# Altium project ODrive_Foc.PrjPcb
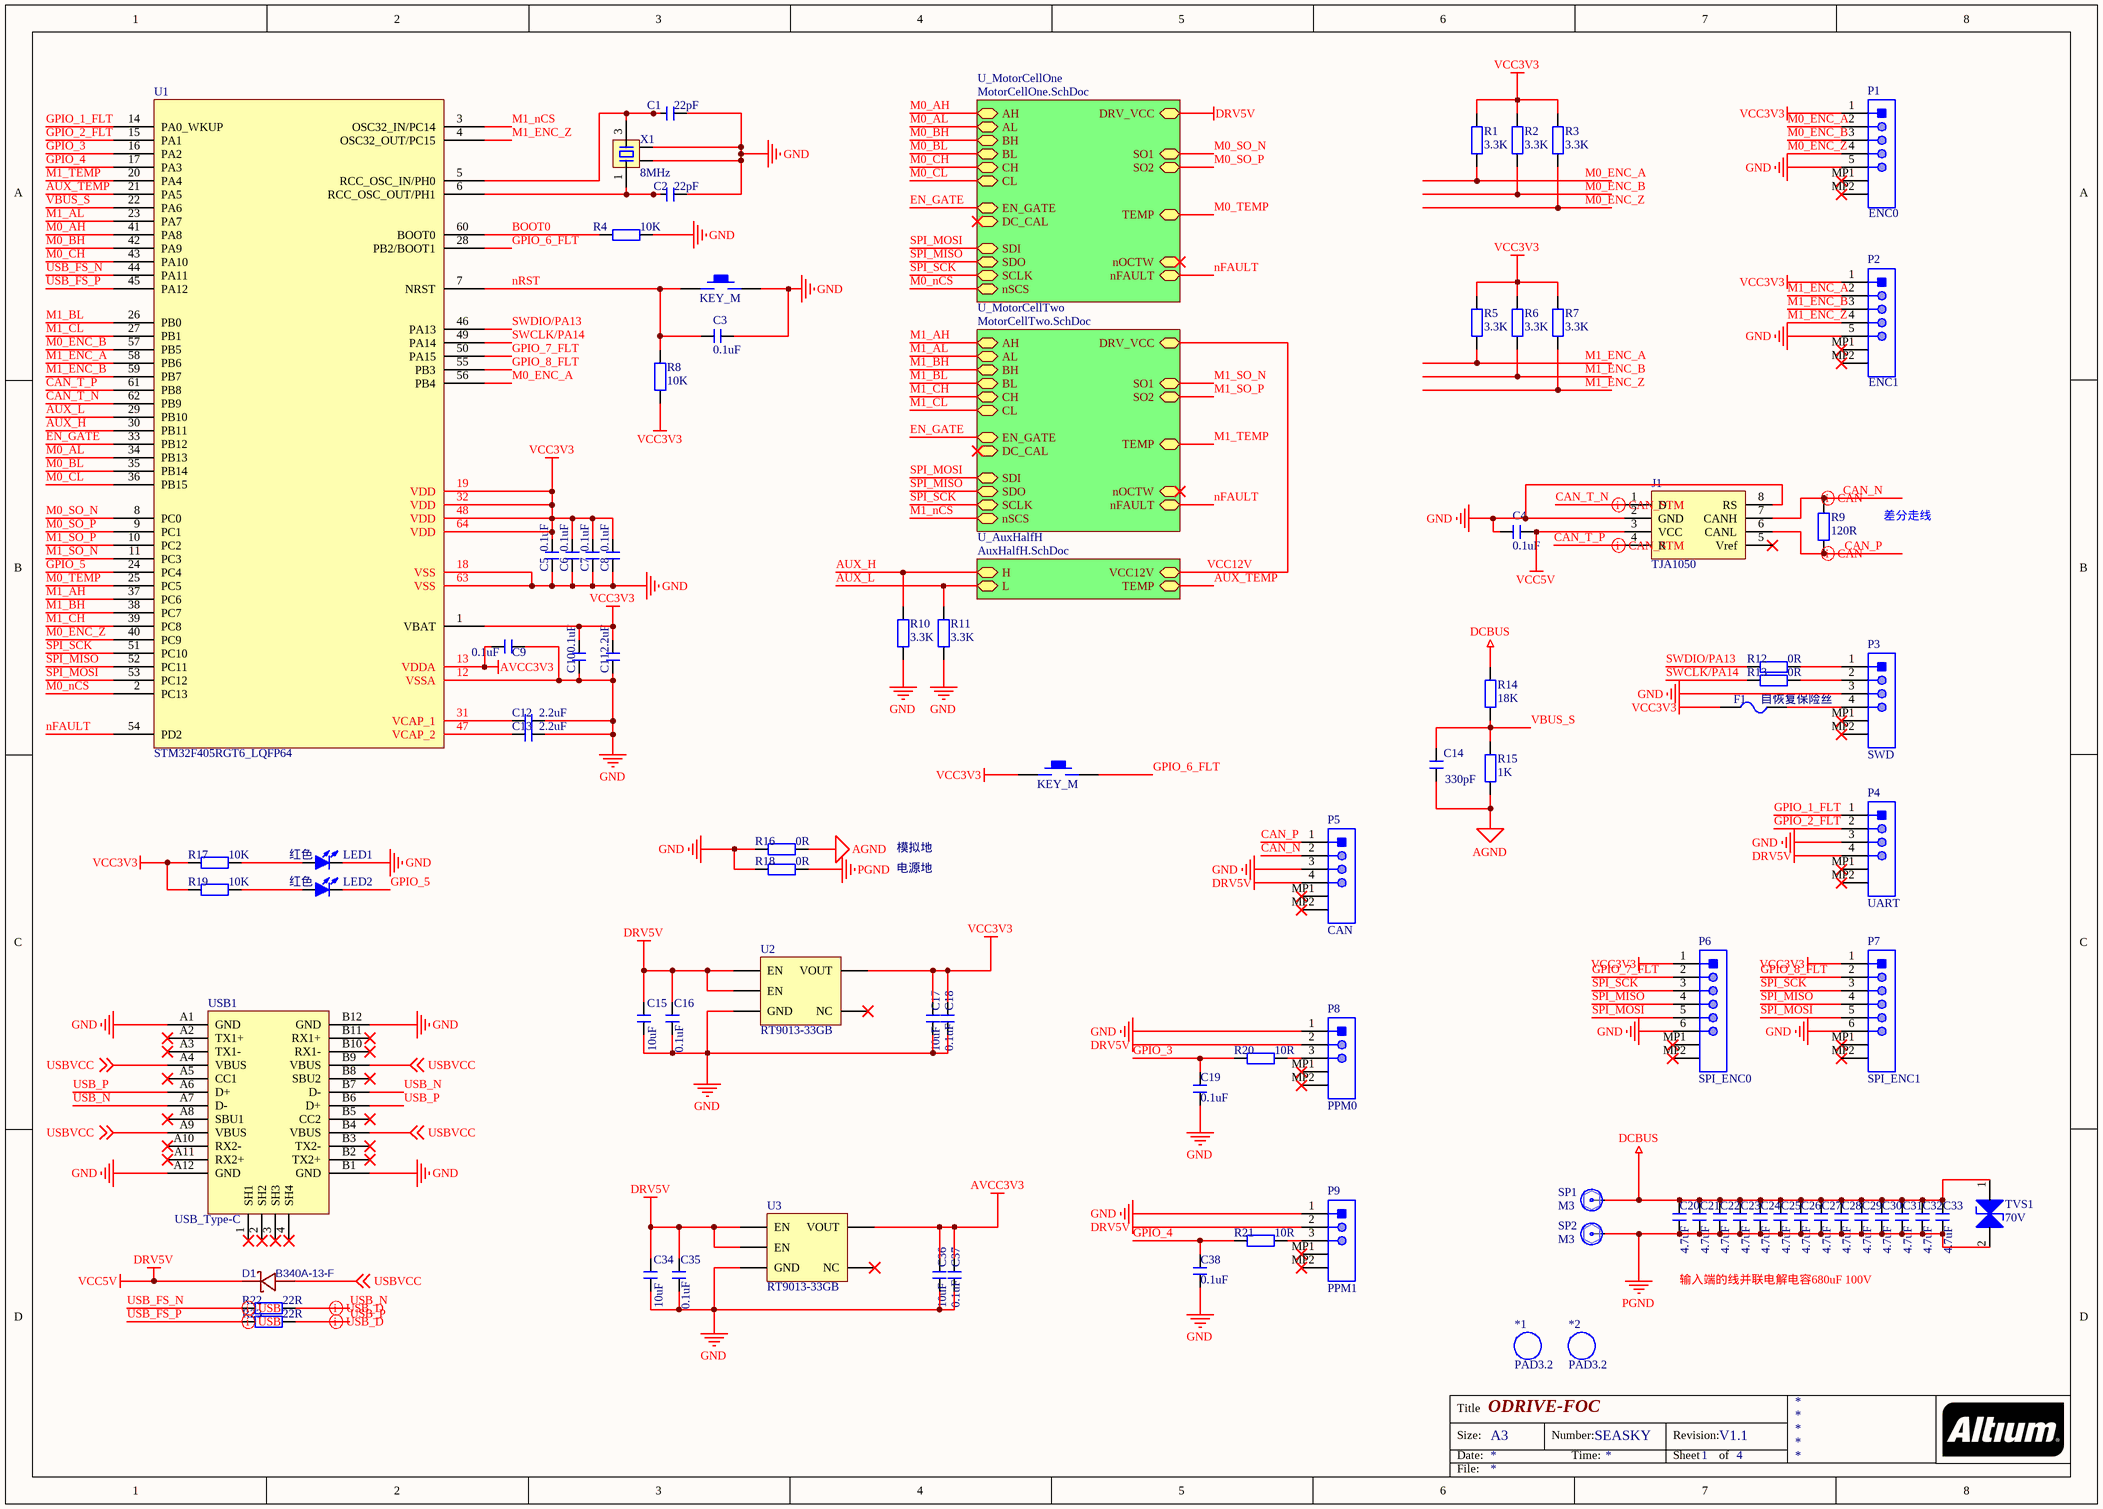
[diagram p0: CoreCtrl.SchDoc]
4 sheets, 208 parts. Net scope: hierarchical (ports join the sheet entries above them; power ports are global).
Board file: Drive_Foc.PcbDoc
Sheets:
  CoreCtrl.SchDoc
    U_AuxHalfH = AuxHalfH.SchDoc
    U_MotorCellOne = MotorCellOne.SchDoc
    U_MotorCellTwo = MotorCellTwo.SchDoc

## Sheet CoreCtrl.SchDoc: ODRIVE-FOC
size A3; Author: SEASKY; DocumentNumber: SEASKY; Revision: V1.1; SheetNumber: 1; SheetTotal: 4; Application_BuildNumber: 0

### Parts
*1  PAD3.2  [PAD3.2]
*2  PAD3.2  [PAD3.2]
C1  22pF  [C 0603_L]
C2  22pF  [C 0603_L]
C3  0.1uF  [C 0603_L]
C4  0.1uF  [C 0603_L]
C5  0.1uF  [C 0603_L]
C6  0.1uF  [C 0603_L]
C7  0.1uF  [C 0603_L]
C8  0.1uF  [C 0603_L]
C9  0.1uF  [C 0603_L]
C10  0.1uF  [C 0603_L]
C11  2.2uF  [C 0603_L]
C12  2.2uF  [C 0603_L]
C13  2.2uF  [C 0603_L]
C14  330pF  [C 0603_L]
C15  10uF  [C 0805_L]
C16  0.1uF  [C 0805_L]
C17  10uF  [C 0805_L]
C18  0.1uF  [C 0805_L]
C19  0.1uF  [C 0603_L]
C20  4.7uF  [C 1210_L]
C21  4.7uF  [C 1210_L]
C22  4.7uF  [C 1210_L]
C23  4.7uF  [C 1210_L]
C24  4.7uF  [C 1210_L]
C25  4.7uF  [C 1210_L]
C26  4.7uF  [C 1210_L]
C27  4.7uF  [C 1210_L]
C28  4.7uF  [C 1210_L]
C29  4.7uF  [C 1210_L]
C30  4.7uF  [C 1210_L]
C31  4.7uF  [C 1210_L]
C32  4.7uF  [C 1210_L]
C33  4.7uF  [C 1210_L]
C34  10uF  [C 0805_L]
C35  0.1uF  [C 0805_L]
C36  10uF  [C 0805_L]
C37  0.1uF  [C 0805_L]
C38  0.1uF  [C 0603_L]
D1  B340A-13-F  [SMA_L4.4-W2.6-LS5.0-RD]
F1  自恢复保险丝  [FU 0603]
J1  TJA1050  [SOIC-8_150mil]
LED1  红色  [LED 0805G]
LED2  红色  [LED 0805G]
P1  ENC0  [JST-SM05B-GHS-TB_V]
P2  ENC1  [JST-SM05B-GHS-TB_V]
P3  SWD  [JST-SM04B-GHS-TB_V]
P4  UART  [JST-SM04B-GHS-TB_V]
P5  CAN  [JST-SM04B-GHS-TB_V]
P6  SPI_ENC0  [JST-SM06B-GHS-TB_V]
P7  SPI_ENC1  [JST-BM06B-GHS-TBT_V]
P8  PPM0  [JST-SM03B-GHS-TB_V]
P9  PPM1  [JST-SM03B-GHS-TB_V]
R1  3.3K  [R 0603_L]
R2  3.3K  [R 0603_L]
R3  3.3K  [R 0603_L]
R4  10K  [R 0603_L]
R5  3.3K  [R 0603_L]
R6  3.3K  [R 0603_L]
R7  3.3K  [R 0603_L]
R8  10K  [R 0603_L]
R9  120R  [R 0603_L]
R10  3.3K  [R 0603_L]
R11  3.3K  [R 0603_L]
R12  0R  [R 0603_L]
R13  0R  [R 0603_L]
R14  18K  [R 0603_L]
R15  1K  [R 0603_L]
R16  0R  [R 0603_L]
R17  10K  [R 0603_L]
R18  0R  [R 0603_L]
R19  10K  [R 0603_L]
R20  10R  [R 0603_L]
R21  10R  [R 0603_L]
R22  22R  [R 0603_L]
R23  22R  [R 0603_L]
RST1  KEY_M  [SMD-3.2*4.2]
RST2  KEY_M  [SMD-3.2*4.2]
SP1  M3  [PAD1.5]
SP2  M3  [PAD1.5]
TVS1  70V  [SMA(DO-214AC)]
U1  STM32F405RGT6_LQFP64  [LQFP-64_10X10X05P]
U2  RT9013-33GB  [SOT23-5M]
U3  RT9013-33GB  [SOT23-5M]
USB1  USB_Type-C  [Type-C-TOP]
X1  8MHz  [OSC 3225-4P]

### Sub-sheets
U_AuxHalfH = AuxHalfH.SchDoc: L (bidir), H (bidir), TEMP (bidir), VCC12V (bidir)
U_MotorCellOne = MotorCellOne.SchDoc: EN_GATE (bidir), AH (bidir), nSCS (bidir), BL (bidir), DC_CAL (bidir), SDI (bidir), SCLK (bidir), nOCTW (bidir), SDO (bidir), BH (bidir), nFAULT (bidir), SO2 (bidir), CL (bidir), CH (bidir), SO1 (bidir), AL (bidir), TEMP (bidir), DRV_VCC (bidir)
U_MotorCellTwo = MotorCellTwo.SchDoc: nSCS (bidir), nOCTW (bidir), SCLK (bidir), AH (bidir), nFAULT (bidir), SDI (bidir), TEMP (bidir), SO1 (bidir), SO2 (bidir), AL (bidir), BL (bidir), SDO (bidir), CL (bidir), BH (bidir), DC_CAL (bidir), EN_GATE (bidir), CH (bidir), DRV_VCC (bidir)

### Nets
AGND: C14.2 R15.2 R16.1
AVCC3V3: C9.2 C36.2 C37.2 U1.13(VDDA) U3.5(VOUT)
DCBUS: C20.2 C21.2 C22.2 C23.2 C24.2 C25.2 C26.2 C27.2 C28.2 C29.2 C30.2 C31.2 C32.2 C33.2 R14.1 SP1.0 TVS1.1
DRV5V: C4.1 C15.2 C16.2 C34.2 C35.2 D1.1(K) J1.3(VCC) P4.4 P5.4 P8.2 P9.2 U2.1(EN) U2.3(EN) U3.1(EN) U3.3(EN) ; sheet U_MotorCellOne/DRV_VCC  [also labelled VCC5V]
GND: C1.2 C2.2 C3.1 C4.2 C5.1 C6.1 C7.1 C8.1 C9.1 C10.1 C11.1 C12.2 C13.2 C15.1 C16.1 C17.1 C18.1 C19.1 C34.1 C35.1 C36.1 C37.1 C38.1 J1.2(GND) J1.8(RS) LED1.2(K) P1.5 P2.5 P3.3 P4.3 P5.3 P6.6 P7.6 P8.1 P9.1 R4.1 R10.2 R11.2 R16.2 R18.2 RST1.2 U1.12(VSSA) U1.18(VSS) U1.63(VSS) U2.2(GND) U3.2(GND) USB1.A1(GND) USB1.A12(GND) USB1.B1(GND) USB1.B12(GND) X1.2 X1.4
PGND: C20.1 C21.1 C22.1 C23.1 C24.1 C25.1 C26.1 C27.1 C28.1 C29.1 C30.1 C31.1 C32.1 C33.1 R18.1 SP2.0 TVS1.2
VCC3V3: C5.2 C6.2 C7.2 C8.2 C10.2 C11.2 C17.2 C18.2 F1.2 P1.1 P2.1 P6.1 P7.1 R1.1 R2.1 R3.1 R5.1 R6.1 R7.1 R8.1 R17.1 R19.1 RST2.1 U1.1(VBAT) U1.19(VDD) U1.32(VDD) U1.48(VDD) U1.64(VDD) U2.5(VOUT)
AUX_H: R10.1 U1.30(PB11) ; sheet U_AuxHalfH/H
AUX_L: R11.1 U1.29(PB10) ; sheet U_AuxHalfH/L
AUX_TEMP: U1.21(PA5) ; sheet U_AuxHalfH/TEMP
BOOT0: R4.2 U1.60(BOOT0)  [project net BOOT0_1]
CAN_N: J1.7(CANH) P5.2 R9.1  [project net CAN_N_1]
CAN_P: J1.6(CANL) P5.1 R9.2  [project net CAN_P_1]
CAN_T_N: J1.1(D) U1.62(PB9)  [project net CAN_T_N_1]
CAN_T_P: J1.4(R) U1.61(PB8)  [project net CAN_T_P_1]
EN_GATE: U1.33(PB12) ; sheet U_MotorCellOne/EN_GATE, sheet U_MotorCellTwo/EN_GATE
GPIO_1_FLT: P4.1 U1.14(PA0_WKUP)  [project net GPIO_1_FLT_1]
GPIO_2_FLT: P4.2 U1.15(PA1)  [project net GPIO_2_FLT_1]
GPIO_3: C19.2 R20.1 U1.16(PA2)  [project net GPIO_3_1]
GPIO_4: C38.2 R21.1 U1.17(PA3)  [project net GPIO_4_1]
GPIO_5: LED2.2(K) U1.24(PC4)  [project net GPIO_5_1]
GPIO_6_FLT: RST2.2 U1.28(PB2/BOOT1)  [project net GPIO_6_FLT_1]
GPIO_7_FLT: P6.2 U1.50(PA15)  [project net GPIO_7_FLT_1]
GPIO_8_FLT: P7.2 U1.55(PB3)  [project net GPIO_8_FLT_1]
M0_AH: U1.41(PA8) ; sheet U_MotorCellOne/AH
M0_AL: U1.34(PB13) ; sheet U_MotorCellOne/AL
M0_BH: U1.42(PA9) ; sheet U_MotorCellOne/BH
M0_BL: U1.35(PB14) ; sheet U_MotorCellOne/BL
M0_CH: U1.43(PA10) ; sheet U_MotorCellOne/CH
M0_CL: U1.36(PB15) ; sheet U_MotorCellOne/CL
M0_ENC_A: P1.2 R1.2 U1.56(PB4)  [project net M0_ENC_A_1]
M0_ENC_B: P1.3 R2.2 U1.57(PB5)  [project net M0_ENC_B_1]
M0_ENC_Z: P1.4 R3.2 U1.40(PC9)  [project net M0_ENC_Z_1]
M0_nCS: U1.2(PC13) ; sheet U_MotorCellOne/nSCS
M0_SO_N: U1.8(PC0) ; sheet U_MotorCellOne/SO1
M0_SO_P: U1.9(PC1) ; sheet U_MotorCellOne/SO2
M0_TEMP: U1.25(PC5) ; sheet U_MotorCellOne/TEMP
M1_AH: U1.37(PC6) ; sheet U_MotorCellTwo/AH
M1_AL: U1.23(PA7) ; sheet U_MotorCellTwo/AL
M1_BH: U1.38(PC7) ; sheet U_MotorCellTwo/BH
M1_BL: U1.26(PB0) ; sheet U_MotorCellTwo/BL
M1_CH: U1.39(PC8) ; sheet U_MotorCellTwo/CH
M1_CL: U1.27(PB1) ; sheet U_MotorCellTwo/CL
M1_ENC_A: P2.2 R5.2 U1.58(PB6)  [project net M1_ENC_A_1]
M1_ENC_B: P2.3 R6.2 U1.59(PB7)  [project net M1_ENC_B_1]
M1_ENC_Z: P2.4 R7.2 U1.4(OSC32_OUT/PC15)  [project net M1_ENC_Z_1]
M1_nCS: U1.3(OSC32_IN/PC14) ; sheet U_MotorCellTwo/nSCS
M1_SO_N: U1.11(PC3) ; sheet U_MotorCellTwo/SO1
M1_SO_P: U1.10(PC2) ; sheet U_MotorCellTwo/SO2
M1_TEMP: U1.20(PA4) ; sheet U_MotorCellTwo/TEMP
nFAULT: U1.54(PD2) ; sheet U_MotorCellOne/nFAULT, sheet U_MotorCellTwo/nFAULT
nRST: C3.2 R8.2 RST1.1 U1.7(NRST)  [project net nRST_1]
SPI_MISO: P6.4 P7.4 U1.52(PC11) ; sheet U_MotorCellOne/SDO, sheet U_MotorCellTwo/SDO
SPI_MOSI: P6.5 P7.5 U1.53(PC12) ; sheet U_MotorCellOne/SDI, sheet U_MotorCellTwo/SDI
SPI_SCK: P6.3 P7.3 U1.51(PC10) ; sheet U_MotorCellOne/SCLK, sheet U_MotorCellTwo/SCLK
SWCLK/PA14: R13.2 U1.49(PA14)  [project net SWCLK/PA14_1]
SWDIO/PA13: R12.2 U1.46(PA13)  [project net SWDIO/PA13_1]
USB_FS_N: R22.1 U1.44(PA11)  [project net USB_FS_N_1]
USB_FS_P: R23.1 U1.45(PA12)  [project net USB_FS_P_1]
USB_N: R22.2 USB1.A7(D-) USB1.B7(D-)  [project net USB_N_1]
USB_P: R23.2 USB1.A6(D+) USB1.B6(D+)  [project net USB_P_1]
USBVCC: D1.2(A) USB1.A4(VBUS) USB1.A9(VBUS) USB1.B4(VBUS) USB1.B9(VBUS) ; off-sheet USBVCC
VBUS_S: C14.1 R14.2 R15.1 U1.22(PA6)  [project net VBUS_S_1]
VCC12V: sheet U_AuxHalfH/VCC12V, sheet U_MotorCellTwo/DRV_VCC
NetC1_1: C1.1 U1.5(RCC_OSC_IN/PH0) X1.3
NetC2_1: C2.1 U1.6(RCC_OSC_OUT/PH1) X1.1
NetC12_1: C12.1 U1.31(VCAP_1)
NetC13_1: C13.1 U1.47(VCAP_2)
NetF1_1: F1.1 P3.4
NetLED1_1: LED1.1(A) R17.2
NetLED2_1: LED2.1(A) R19.2
NetP3_1: P3.1 R12.1
NetP3_2: P3.2 R13.1
NetP8_3: P8.3 R20.2
NetP9_3: P9.3 R21.2

Not connected (* = marked no-connect by the designer): J1 5(Vref)*; P1 MP1* MP2*; P2 MP1* MP2*; P3 MP1* MP2*; P4 MP1* MP2*; P5 MP1* MP2*; P6 MP1* MP2*; P7 MP1* MP2*; P8 MP1* MP2*; P9 MP1* MP2*; U2 4(NC)*; U3 4(NC)*; USB1 1(SH1)* 2(SH2)* 3(SH3)* 4(SH4)* A2(TX1+)* A3(TX1-)* A5(CC1)* A8(SBU1)* A10(RX2-)* A11(RX2+)* B2(TX2+)* B3(TX2-)* B5(CC2)* B8(SBU2)* B10(RX1-)* B11(RX1+)*

### Layout directives
differential pair: CAN_N_1, CAN_P_1, CAN_T_N_1, CAN_T_P_1, USB_FS_N_1, USB_FS_P_1, USB_N_1, USB_P_1

### Notes on the sheet
- 差分走线
- 模拟地
- 电源地
- 输入端的线并联电解电容680uF 100V
- Title
- Size:
- Date:
- A3
- Number:
- Time:
- Revision:
- Sheet
- of
- File:

### Library data of the parts
C1-C38 = C: 贴片电容
D1 = B340A-13-F: BOM_Manufacturer: DIODES; SMT Type: Extend; BOM_Supplier: LCSC; BOM_Manufacturer Part: B340A-13-F; BOM_Supplier Part: C85098; BOM_JLCPCB SMD: Yes; spicePre: D; spiceSymbolName: B340A-13-F
F1 = FU: 贴片保险丝
J1 = TJA1050: CAN芯片
LED1 LED2 = LED-SMD: 贴片LED
P1 P2 = SM05B-GHS-TB(LF)(SN): GH Disconnectable Crimp Style Connector, Pitch 1.25 mm, 1 x 5 Position, Height 4.25 mm, -25 to 85 degC, RoHS, Tape and Reel; Manufacturer: JST; No of Positions: 5; Pitch: 1.25mm; Style/Orientation: RightAngleHeader/Plug; Package Reference: SM05B-GHS-TB; Type: WiretoBoard; Datasheet URL: http://www.jst-mfg.com/product/pdf/eng/eGH.pdf; Termination: Crimp; Manufacturer URL: http://www.jst.com/home2.html; Mounting Technology: SurfaceMount; Datasheet Version: 05/2016; Package Description: GH Disconnectable Crimp Style Connector, Pitch 1.25 mm, 1 x 5 Position, Height 4.25 mm
P3-P5 = SM04B-GHS-TB(LF)(SN): GH Disconnectable Crimp Style Connector, Pitch 1.25 mm, 1 x 4 Position, Height 4.25 mm, -25 to 85 degC, RoHS, Tape and Reel; Manufacturer: JST; No of Positions: 4; Pitch: 1.25mm; Style/Orientation: RightAngleHeader/Plug; Package Reference: SM04B-GHS-TB; Type: WiretoBoard; Datasheet URL: http://www.jst-mfg.com/product/pdf/eng/eGH.pdf; Termination: Crimp; Manufacturer URL: http://www.jst.com/home2.html; Mounting Technology: SurfaceMount; Datasheet Version: 05/2016; Package Description: GH Disconnectable Crimp Style Connector, Pitch 1.25 mm, 1 x 4 Position, Height 4.25 mm
P6 = SM06B-GHS-TB(LF)(SN): GH Disconnectable Crimp Style Connector, Pitch 1.25 mm, 1 x 6 Position, Height 4.25 mm, -25 to 85 degC, RoHS, Tape and Reel; Manufacturer: JST; No of Positions: 6; Pitch: 1.25mm; Style/Orientation: RightAngleHeader/Plug; Package Reference: SM06B-GHS-TB; Type: WiretoBoard; Datasheet URL: http://www.jst-mfg.com/product/pdf/eng/eGH.pdf; Termination: Crimp; Manufacturer URL: http://www.jst.com/home2.html; Mounting Technology: SurfaceMount; Datasheet Version: 05/2016; Package Description: GH Disconnectable Crimp Style Connector, Pitch 1.25 mm, 1 x 6 Position, Height 4.25 mm
P7 = BM06B-GHS-TBT(LF)(SN): GH Disconnectable Crimp Style Connector, Pitch 1.25 mm, 1 x 6 Position, Height 4.05 mm, -25 to 85 degC, RoHS, Tape and Reel; Manufacturer: JST; No of Positions: 6; Pitch: 1.25mm; Style/Orientation: StraightHeader/Plug; Package Reference: BM06B-GHS-TBT; Type: WiretoBoard; Datasheet URL: http://www.jst-mfg.com/product/pdf/eng/eGH.pdf; Termination: Crimp; Manufacturer URL: http://www.jst.com/home2.html; Mounting Technology: SurfaceMount; Datasheet Version: 05/2016; Package Description: GH Disconnectable Crimp Style Connector, Pitch 1.25 mm, 1 x 6 Position, Height 4.05 mm
P8 P9 = SM03B-GHS-TB(LF)(SN): GH Disconnectable Crimp Style Connector, Pitch 1.25 mm, 1 x 3 Position, Height 4.25 mm, -25 to 85 degC, RoHS, Tape and Reel; Manufacturer: JST; No of Positions: 3; Pitch: 1.25mm; Style/Orientation: RightAngleHeader/Plug; Package Reference: SM03B-GHS-TB; Type: WiretoBoard; Datasheet URL: http://www.jst-mfg.com/product/pdf/eng/eGH.pdf; Termination: Crimp; Manufacturer URL: http://www.jst.com/home2.html; Mounting Technology: SurfaceMount; Datasheet Version: 05/2016; Package Description: GH Disconnectable Crimp Style Connector, Pitch 1.25 mm, 1 x 3 Position, Height 4.25 mm
R1-R23 = R: 贴片电阻
SP1 SP2 = 固定焊盘: 铜柱
TVS1 = SMAJ28CA
X1 = XTAL-4P: 4脚无源晶振

## Sheet AuxHalfH.SchDoc: ODRIVE-FOC
size A3; DocumentNumber: SEASKY; Revision: V1.1
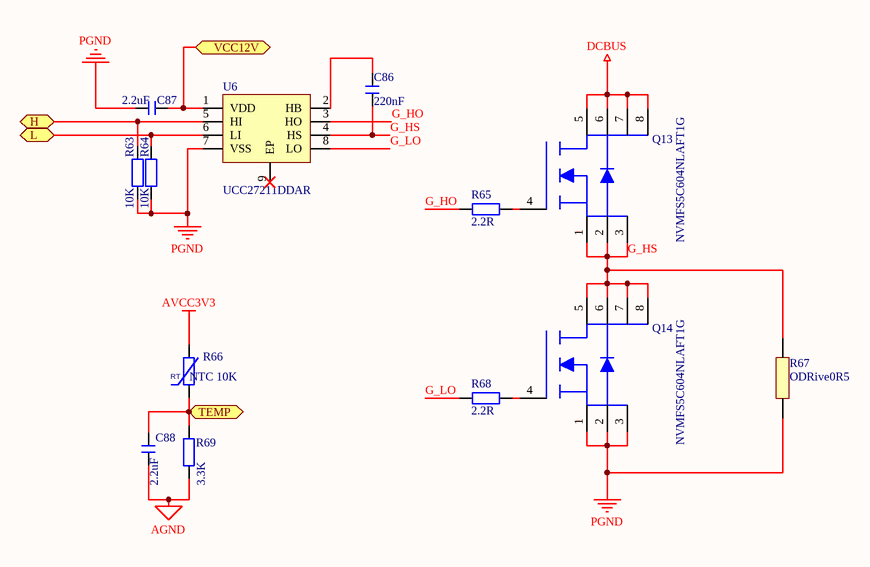
[diagram p1: AuxHalfH.SchDoc]

### Parts
C86  220nF  [C 0805_L]
C87  2.2uF  [C 0603_L]
C88  2.2uF  [C 0603_L]
Q13  NVMFS5C604NLAFT1G  [PG-TDSON-8_L5.0-W6.0-P1.27-LS6.2-BL-EP]
Q14  NVMFS5C604NLAFT1G  [PG-TDSON-8_L5.0-W6.0-P1.27-LS6.2-BL-EP]
R63  10K  [R 0603_L]
R64  10K  [R 0603_L]
R65  2.2R  [R 0603_L]
R66  NTC 10K  [R 0805-HP_L]
R67  ODRive0R5  [ODrive_0R5]
R68  2.2R  [R 0603_L]
R69  3.3K  [R 0805_L]
U6  UCC27211DDAR  [SO-8_EP]

### Ports
H (bidir), L (bidir), TEMP (bidir), VCC12V (bidir)

### Nets
AGND: C88.2 R69.1
AVCC3V3: R66.2
DCBUS: Q13.5 Q13.6 Q13.7 Q13.8
PGND: C87.2 Q14.1 Q14.2 Q14.3 R63.1 R64.1 R67.1 U6.7(VSS)
AUX_H: R63.2 U6.5(HI) ; port H
AUX_L: R64.2 U6.6(LI) ; port L
AUX_TEMP: C88.1 R66.1 R69.2 ; port TEMP
G_HO: R65.1 U6.3(HO)
G_HS: C86.1 Q13.1 Q13.2 Q13.3 Q14.5 Q14.6 Q14.7 Q14.8 R67.2 U6.4(HS)
G_LO: R68.1 U6.8(LO)
VCC12V: C87.1 U6.1(VDD) ; port VCC12V
NetC86_2: C86.2 U6.2(HB)
NetQ13_4: Q13.4 R65.2
NetQ14_4: Q14.4 R68.2

Not connected (* = marked no-connect by the designer): U6 9(EP)*

### Notes on the sheet
- Title
- Size:
- Date:
- A3
- Number:
- Time:
- Revision:
- Sheet
- of
- File:

### Library data of the parts
C86-C88 = C: 贴片电容
Q13 Q14 = BSC037N08NS5ATMA1
R63-R65 R68 R69 = R: 贴片电阻
R66 = RT: 热敏电阻

## Sheet MotorCellOne.SchDoc: ODRIVE-FOC
size A3; DocumentNumber: SEASKY; Revision: V1.1
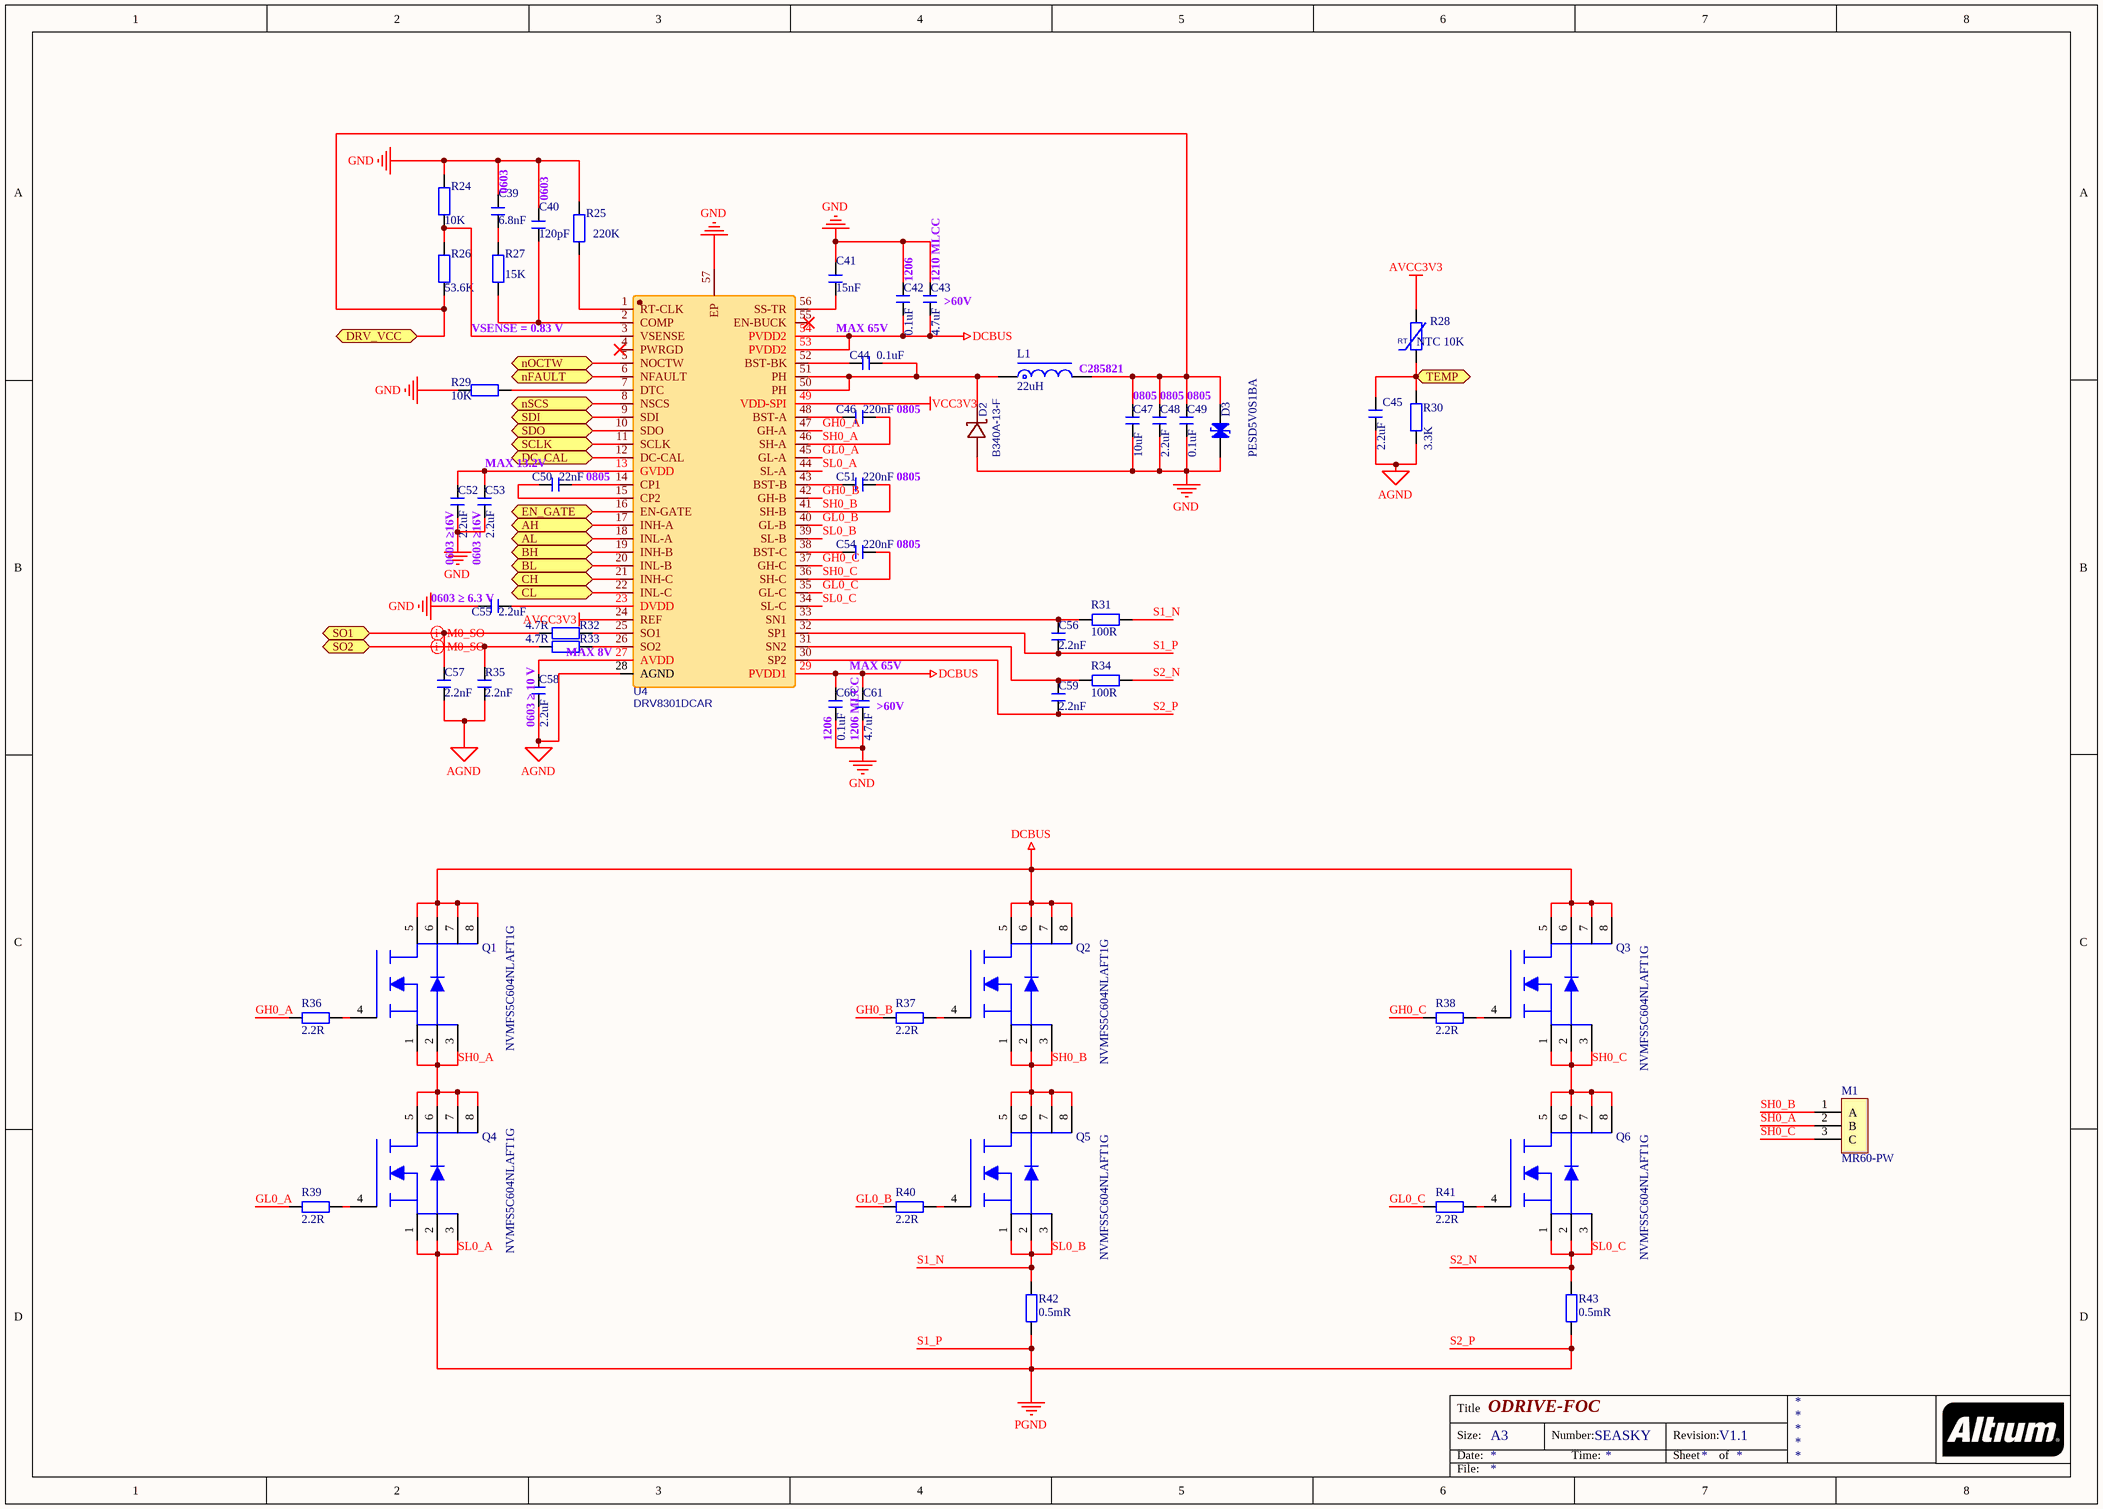
[diagram p2: MotorCellOne.SchDoc]

### Parts
C39  6.8nF  [C 0603_L]
C40  120pF  [C 0603_L]
C41  15nF  [C 0603_L]
C42  0.1uF  [C 1206_L]
C43  4.7uF  [C 1210_L]
C44  0.1uF  [C 0603_L]
C45  2.2uF  [C 0603_L]
C46  220nF  [C 0805_L]
C47  10uF  [C 0805_L]
C48  2.2uF  [C 0805_L]
C49  0.1uF  [C 0805_L]
C50  22nF  [C 0805_L]
C51  220nF  [C 0805_L]
C52  2.2uF  [C 0603_L]
C53  2.2uF  [C 0603_L]
C54  220nF  [C 0805_L]
C55  2.2uF  [C 0603_L]
C56  2.2nF  [C 0603_L]
C57  2.2nF  [C 0603_L]
C58  2.2uF  [C 0603_L]
C59  2.2nF  [C 0603_L]
C60  0.1uF  [C 1206_L]
C61  4.7uF  [C 1210_L]
D2  B340A-13-F  [SMA_L4.4-W2.6-LS5.0-RD]
D3  PESD5V0S1BA  [SOD-323]
L1  22uH  [CD53]
M1  MR60-PW  [MR60-PW]
Q1  NVMFS5C604NLAFT1G  [PG-TDSON-8_L5.0-W6.0-P1.27-LS6.2-BL-EP]
Q2  NVMFS5C604NLAFT1G  [PG-TDSON-8_L5.0-W6.0-P1.27-LS6.2-BL-EP]
Q3  NVMFS5C604NLAFT1G  [PG-TDSON-8_L5.0-W6.0-P1.27-LS6.2-BL-EP]
Q4  NVMFS5C604NLAFT1G  [PG-TDSON-8_L5.0-W6.0-P1.27-LS6.2-BL-EP]
Q5  NVMFS5C604NLAFT1G  [PG-TDSON-8_L5.0-W6.0-P1.27-LS6.2-BL-EP]
Q6  NVMFS5C604NLAFT1G  [PG-TDSON-8_L5.0-W6.0-P1.27-LS6.2-BL-EP]
R24  10K  [R 0603_L]
R25  220K  [R 0603_L]
R26  53.6K  [R 0603_L]
R27  15K  [R 0603_L]
R28  NTC 10K  [R 0805-HP_L]
R29  10K  [R 0603_L]
R30  3.3K  [R 0805_L]
R31  100R  [R 0603_L]
R32  4.7R  [R 0603_L]
R33  4.7R  [R 0603_L]
R34  100R  [R 0603_L]
R35  2.2nF  [C 0603_L]
R36  2.2R  [R 0603_L]
R37  2.2R  [R 0603_L]
R38  2.2R  [R 0603_L]
R39  2.2R  [R 0603_L]
R40  2.2R  [R 0603_L]
R41  2.2R  [R 0603_L]
R42  0.5mR  [R3920]
R43  0.5mR  [R3920]
U4  DRV8301DCAR  [HTSSOP-56_L14.0-W6.0-P0.50-LS8.0-BL]

### Ports
AH (bidir), AL (bidir), BH (bidir), BL (bidir), CH (bidir), CL (bidir), DC_CAL (bidir), DRV_VCC (bidir), EN_GATE (bidir), nFAULT (bidir), nOCTW (bidir), nSCS (bidir), SCLK (bidir), SDI (bidir), SDO (bidir), SO1 (bidir), SO2 (bidir), TEMP (bidir)

### Nets
AGND: C45.2 C57.1 C58.1 R30.1 R35.1 U4.28(AGND)
AVCC3V3: R28.2 U4.24(REF)
DCBUS: C42.1 C43.1 C60.2 C61.2 Q1.5 Q1.6 Q1.7 Q1.8 Q2.5 Q2.6 Q2.7 Q2.8 Q3.5 Q3.6 Q3.7 Q3.8 U4.29(PVDD1) U4.53(PVDD2) U4.54(PVDD2)
DRV5V: C47.2 C48.2 C49.2 D3.1(A) L1.2 R26.1 ; port DRV_VCC
GND: C39.1 C40.1 C41.1 C42.2 C43.2 C47.1 C48.1 C49.1 C52.1 C53.1 C55.1 C60.1 C61.1 D2.2(A) D3.2(K) R24.2 R25.2 R29.2 U4.57(EP)
PGND: C56.1 C59.1 Q4.1 Q4.2 Q4.3 R42.1 R43.1 U4.30(SP2) U4.32(SP1) U4.44(SL-A)  [also labelled S1_P, S2_P, SL0_A]
VCC3V3: U4.49(VDD-SPI)
EN_GATE: U4.16(EN-GATE) ; port EN_GATE
GH0_A: R36.1 U4.47(GH-A)
GH0_B: R37.1 U4.42(GH-B)
GH0_C: R38.1 U4.37(GH-C)
GL0_A: R39.1 U4.45(GL-A)
GL0_B: R40.1 U4.40(GL-B)
GL0_C: R41.1 U4.35(GL-C)
M0_AH: U4.17(INH-A) ; port AH
M0_AL: U4.18(INL-A) ; port AL
M0_BH: U4.19(INH-B) ; port BH
M0_BL: U4.20(INL-B) ; port BL
M0_CH: U4.21(INH-C) ; port CH
M0_CL: U4.22(INL-C) ; port CL
M0_nCS: U4.8(NSCS) ; port nSCS
M0_SO_N: C57.2 R32.1 ; port SO1
M0_SO_P: R33.1 R35.2 ; port SO2
M0_TEMP: C45.1 R28.1 R30.2 ; port TEMP
nFAULT: U4.6(NFAULT) ; port nFAULT
S1_N: Q5.1 Q5.2 Q5.3 R31.2 R42.2 U4.39(SL-B)  [also labelled SL0_B]
S2_N: Q6.1 Q6.2 Q6.3 R34.2 R43.2 U4.34(SL-C)  [also labelled SL0_C]
SH0_A: C46.2 M1.2(B) Q1.1 Q1.2 Q1.3 Q4.5 Q4.6 Q4.7 Q4.8 U4.46(SH-A)
SH0_B: C51.2 M1.1(A) Q2.1 Q2.2 Q2.3 Q5.5 Q5.6 Q5.7 Q5.8 U4.41(SH-B)
SH0_C: C54.2 M1.3(C) Q3.1 Q3.2 Q3.3 Q6.5 Q6.6 Q6.7 Q6.8 U4.36(SH-C)
SPI_MISO: U4.10(SDO) ; port SDO
SPI_MOSI: U4.9(SDI) ; port SDI
SPI_SCK: U4.11(SCLK) ; port SCLK
NetC39_2: C39.2 R27.2
NetC40_2: C40.2 R27.1 U4.2(COMP)
NetC41_2: C41.2 U4.56(SS-TR)
NetC44_1: C44.1 D2.1(K) L1.1 U4.50(PH) U4.51(PH)
NetC44_2: C44.2 U4.52(BST-BK)
NetC46_1: C46.1 U4.48(BST-A)
NetC50_1: C50.1 U4.14(CP1)
NetC50_2: C50.2 U4.15(CP2)
NetC51_1: C51.1 U4.43(BST-B)
NetC52_2: C52.2 C53.2 U4.13(GVDD)
NetC54_1: C54.1 U4.38(BST-C)
NetC55_2: C55.2 U4.23(DVDD)
NetC56_2: C56.2 R31.1 U4.33(SN1)
NetC58_2: C58.2 U4.27(AVDD)
NetC59_2: C59.2 R34.1 U4.31(SN2)
NetQ1_4: Q1.4 R36.2
NetQ2_4: Q2.4 R37.2
NetQ3_4: Q3.4 R38.2
NetQ4_4: Q4.4 R39.2
NetQ5_4: Q5.4 R40.2
NetQ6_4: Q6.4 R41.2
NetR24_1: R24.1 R26.2 U4.3(VSENSE)
NetR25_1: R25.1 U4.1(RT-CLK)
NetR29_1: R29.1 U4.7(DTC)
NetR32_2: R32.2 U4.25(SO1)
NetR33_2: R33.2 U4.26(SO2)
NetU4_5: U4.5(NOCTW) ; port nOCTW
NetU4_12: U4.12(DC-CAL) ; port DC_CAL

Not connected (* = marked no-connect by the designer): U4 4(PWRGD)* 55(EN-BUCK)*

### Layout directives
differential pair: M0_SO_N, M0_SO_P

### Notes on the sheet
- (near C39) 0603
- 0603
- 1206
- (near C43) >60V
- (near C43) 1210 MLCC
- VSENSE = 0.83 V
- MAX 65V
- (near L1) C285821
- 0805
- MAX 13.2V
- (near C51) 0805
- (near C52) 0603 ≥16V
- (near C53) 0603 ≥16V
- (near C54) 0805
- (near C55) 0603 ≥ 6.3 V
- (near C58) 0603 ≥ 10 V
- (near R33) MAX 8V
- (near C61) >60V
- (near C60) 1206
- (near C61) 1206 MLCC
- Title
- Size:
- Date:
- A3
- Number:
- Time:
- Revision:
- Sheet
- of
- File:

### Library data of the parts
C39-C61 R35 = C: 贴片电容
D2 = B340A-13-F: as D1 on sheet CoreCtrl; BOM_Supplier: LCSC; BOM_Manufacturer Part: B340A-13-F; BOM_Supplier Part: C85098; BOM_JLCPCB SMD: Yes; spicePre: D; spiceSymbolName: B340A-13-F
D3 = PESD5V0S1BA: PESD5V0S1BA、ESD二极管、5V
L1 = L-SMD: CD系列贴片线绕功率电感
Q1-Q6 = BSC037N08NS5ATMA1
R24-R27 R29-R34 R36-R41 = R: 贴片电阻
R28 = RT: 热敏电阻
R42 R43 = R-Precision: 精密贴片电阻
U4 = DRV8301DCAR: BOM_Manufacturer: Texas Instruments; Contributor: LCSC; SMT Type: Extend; BOM_Supplier: LCSC; BOM_Supplier Part: C98969; BOM_Manufacturer Part: DRV8301DCAR; BOM_JLCPCB SMD: Yes; spicePre: U; spiceSymbolName: DRV8301DCAR

## Sheet MotorCellTwo.SchDoc: ODRIVE-FOC
size A3; DocumentNumber: SEASKY; Revision: V1.1
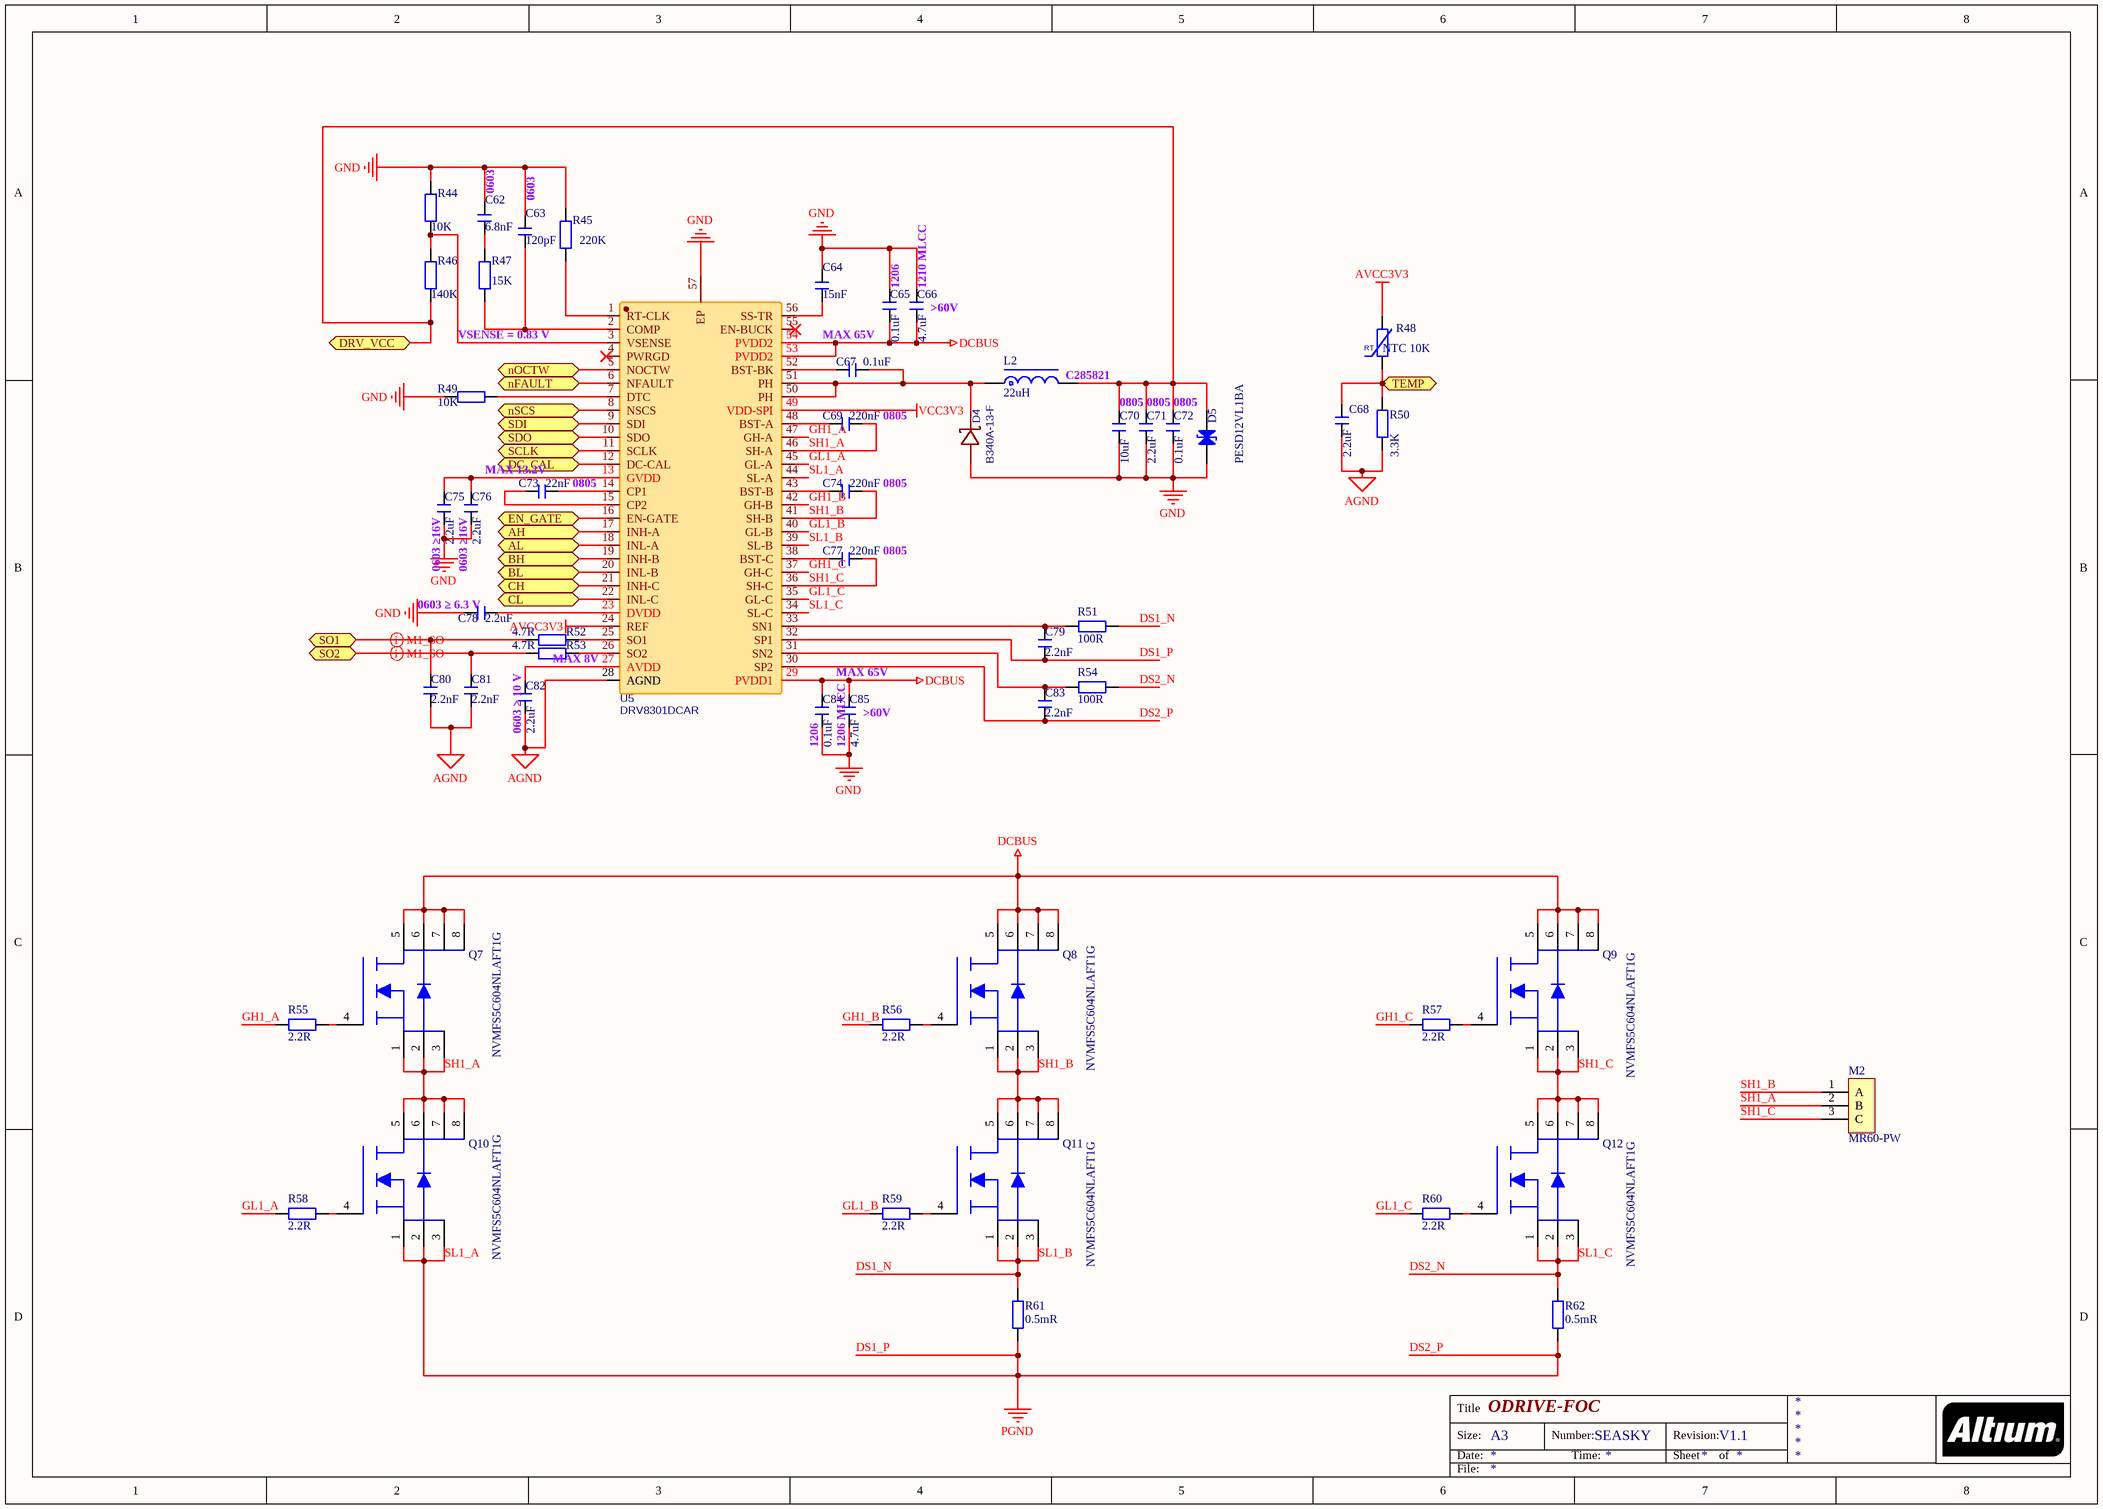
[diagram p3: MotorCellTwo.SchDoc]

### Parts
C62  6.8nF  [C 0603_L]
C63  120pF  [C 0603_L]
C64  15nF  [C 0603_L]
C65  0.1uF  [C 1206_L]
C66  4.7uF  [C 1210_L]
C67  0.1uF  [C 0603_L]
C68  2.2uF  [C 0603_L]
C69  220nF  [C 0805_L]
C70  10uF  [C 0805_L]
C71  2.2uF  [C 0805_L]
C72  0.1uF  [C 0805_L]
C73  22nF  [C 0805_L]
C74  220nF  [C 0805_L]
C75  2.2uF  [C 0603_L]
C76  2.2uF  [C 0603_L]
C77  220nF  [C 0805_L]
C78  2.2uF  [C 0603_L]
C79  2.2nF  [C 0603_L]
C80  2.2nF  [C 0603_L]
C81  2.2nF  [C 0603_L]
C82  2.2uF  [C 0603_L]
C83  2.2nF  [C 0603_L]
C84  0.1uF  [C 1206_L]
C85  4.7uF  [C 1210_L]
D4  B340A-13-F  [SMA_L4.4-W2.6-LS5.0-RD]
D5  PESD12VL1BA  [SOD-323]
L2  22uH  [CD53]
M2  MR60-PW  [MR60-PW]
Q7  NVMFS5C604NLAFT1G  [PG-TDSON-8_L5.0-W6.0-P1.27-LS6.2-BL-EP]
Q8  NVMFS5C604NLAFT1G  [PG-TDSON-8_L5.0-W6.0-P1.27-LS6.2-BL-EP]
Q9  NVMFS5C604NLAFT1G  [PG-TDSON-8_L5.0-W6.0-P1.27-LS6.2-BL-EP]
Q10  NVMFS5C604NLAFT1G  [PG-TDSON-8_L5.0-W6.0-P1.27-LS6.2-BL-EP]
Q11  NVMFS5C604NLAFT1G  [PG-TDSON-8_L5.0-W6.0-P1.27-LS6.2-BL-EP]
Q12  NVMFS5C604NLAFT1G  [PG-TDSON-8_L5.0-W6.0-P1.27-LS6.2-BL-EP]
R44  10K  [R 0603_L]
R45  220K  [R 0603_L]
R46  140K  [R 0603_L]
R47  15K  [R 0603_L]
R48  NTC 10K  [R 0805-HP_L]
R49  10K  [R 0603_L]
R50  3.3K  [R 0805_L]
R51  100R  [R 0603_L]
R52  4.7R  [R 0603_L]
R53  4.7R  [R 0603_L]
R54  100R  [R 0603_L]
R55  2.2R  [R 0603_L]
R56  2.2R  [R 0603_L]
R57  2.2R  [R 0603_L]
R58  2.2R  [R 0603_L]
R59  2.2R  [R 0603_L]
R60  2.2R  [R 0603_L]
R61  0.5mR  [R3920]
R62  0.5mR  [R3920]
U5  DRV8301DCAR  [HTSSOP-56_L14.0-W6.0-P0.50-LS8.0-BL]

### Ports
AH (bidir), AL (bidir), BH (bidir), BL (bidir), CH (bidir), CL (bidir), DC_CAL (bidir), DRV_VCC (bidir), EN_GATE (bidir), nFAULT (bidir), nOCTW (bidir), nSCS (bidir), SCLK (bidir), SDI (bidir), SDO (bidir), SO1 (bidir), SO2 (bidir), TEMP (bidir)

### Nets
AGND: C68.2 C80.1 C81.1 C82.1 R50.1 U5.28(AGND)
AVCC3V3: R48.2 U5.24(REF)
DCBUS: C65.1 C66.1 C84.2 C85.2 Q7.5 Q7.6 Q7.7 Q7.8 Q8.5 Q8.6 Q8.7 Q8.8 Q9.5 Q9.6 Q9.7 Q9.8 U5.29(PVDD1) U5.53(PVDD2) U5.54(PVDD2)
GND: C62.1 C63.1 C64.1 C65.2 C66.2 C70.1 C71.1 C72.1 C75.1 C76.1 C78.1 C84.1 C85.1 D4.2(A) D5.2(K) R44.2 R45.2 R49.2 U5.57(EP)
PGND: C79.1 C83.1 Q10.1 Q10.2 Q10.3 R61.1 R62.1 U5.30(SP2) U5.32(SP1) U5.44(SL-A)  [also labelled DS1_P, DS2_P, SL1_A]
VCC3V3: U5.49(VDD-SPI)
DS1_N: Q11.1 Q11.2 Q11.3 R51.2 R61.2 U5.39(SL-B)  [also labelled SL1_B]
DS2_N: Q12.1 Q12.2 Q12.3 R54.2 R62.2 U5.34(SL-C)  [also labelled SL1_C]
EN_GATE: U5.16(EN-GATE) ; port EN_GATE
GH1_A: R55.1 U5.47(GH-A)
GH1_B: R56.1 U5.42(GH-B)
GH1_C: R57.1 U5.37(GH-C)
GL1_A: R58.1 U5.45(GL-A)
GL1_B: R59.1 U5.40(GL-B)
GL1_C: R60.1 U5.35(GL-C)
M1_AH: U5.17(INH-A) ; port AH
M1_AL: U5.18(INL-A) ; port AL
M1_BH: U5.19(INH-B) ; port BH
M1_BL: U5.20(INL-B) ; port BL
M1_CH: U5.21(INH-C) ; port CH
M1_CL: U5.22(INL-C) ; port CL
M1_nCS: U5.8(NSCS) ; port nSCS
M1_SO_N: C80.2 R52.1 ; port SO1
M1_SO_P: C81.2 R53.1 ; port SO2
M1_TEMP: C68.1 R48.1 R50.2 ; port TEMP
nFAULT: U5.6(NFAULT) ; port nFAULT
SH1_A: C69.2 M2.2(B) Q7.1 Q7.2 Q7.3 Q10.5 Q10.6 Q10.7 Q10.8 U5.46(SH-A)
SH1_B: C74.2 M2.1(A) Q8.1 Q8.2 Q8.3 Q11.5 Q11.6 Q11.7 Q11.8 U5.41(SH-B)
SH1_C: C77.2 M2.3(C) Q9.1 Q9.2 Q9.3 Q12.5 Q12.6 Q12.7 Q12.8 U5.36(SH-C)
SPI_MISO: U5.10(SDO) ; port SDO
SPI_MOSI: U5.9(SDI) ; port SDI
SPI_SCK: U5.11(SCLK) ; port SCLK
VCC12V: C70.2 C71.2 C72.2 D5.1(A) L2.2 R46.1 ; port DRV_VCC
NetC62_2: C62.2 R47.2
NetC63_2: C63.2 R47.1 U5.2(COMP)
NetC64_2: C64.2 U5.56(SS-TR)
NetC67_1: C67.1 D4.1(K) L2.1 U5.50(PH) U5.51(PH)
NetC67_2: C67.2 U5.52(BST-BK)
NetC69_1: C69.1 U5.48(BST-A)
NetC73_1: C73.1 U5.14(CP1)
NetC73_2: C73.2 U5.15(CP2)
NetC74_1: C74.1 U5.43(BST-B)
NetC75_2: C75.2 C76.2 U5.13(GVDD)
NetC77_1: C77.1 U5.38(BST-C)
NetC78_2: C78.2 U5.23(DVDD)
NetC79_2: C79.2 R51.1 U5.33(SN1)
NetC82_2: C82.2 U5.27(AVDD)
NetC83_2: C83.2 R54.1 U5.31(SN2)
NetQ7_4: Q7.4 R55.2
NetQ8_4: Q8.4 R56.2
NetQ9_4: Q9.4 R57.2
NetQ10_4: Q10.4 R58.2
NetQ11_4: Q11.4 R59.2
NetQ12_4: Q12.4 R60.2
NetR44_1: R44.1 R46.2 U5.3(VSENSE)
NetR45_1: R45.1 U5.1(RT-CLK)
NetR49_1: R49.1 U5.7(DTC)
NetR52_2: R52.2 U5.25(SO1)
NetR53_2: R53.2 U5.26(SO2)
NetU5_5: U5.5(NOCTW) ; port nOCTW
NetU5_12: U5.12(DC-CAL) ; port DC_CAL

Not connected (* = marked no-connect by the designer): U5 4(PWRGD)* 55(EN-BUCK)*

### Layout directives
differential pair: M1_SO_N, M1_SO_P

### Notes on the sheet
- (near C62) 0603
- 0603
- 1206
- (near C66) >60V
- (near C66) 1210 MLCC
- VSENSE = 0.83 V
- MAX 65V
- (near L2) C285821
- 0805
- (near C73) MAX 13.2V
- (near C74) 0805
- (near C75) 0603 ≥16V
- (near C76) 0603 ≥16V
- (near C77) 0805
- (near C78) 0603 ≥ 6.3 V
- (near R53) MAX 8V
- (near C85) >60V
- (near C82) 0603 ≥ 10 V
- (near C84) 1206
- (near C85) 1206 MLCC
- Title
- Size:
- Date:
- A3
- Number:
- Time:
- Revision:
- Sheet
- of
- File:

### Library data of the parts
C62-C85 = C: 贴片电容
D4 = B340A-13-F: as D1 on sheet CoreCtrl; BOM_Supplier: LCSC; BOM_Manufacturer Part: B340A-13-F; BOM_Supplier Part: C85098; BOM_JLCPCB SMD: Yes; spicePre: D; spiceSymbolName: B340A-13-F
D5 = PESD5V0S1BA: PESD5V0S1BA、ESD二极管、5V
L2 = L-SMD: CD系列贴片线绕功率电感
Q7-Q12 = BSC037N08NS5ATMA1
R44-R47 R49-R60 = R: 贴片电阻
R48 = RT: 热敏电阻
R61 R62 = R-Precision: 精密贴片电阻
U5 = DRV8301DCAR: as U4 on sheet MotorCellOne; BOM_Supplier: LCSC; BOM_Supplier Part: C98969; BOM_Manufacturer Part: DRV8301DCAR; BOM_JLCPCB SMD: Yes; spicePre: U; spiceSymbolName: DRV8301DCAR

## Nets that join several sheets
AGND: CoreCtrl (C14.2 R15.2 R16.1), AuxHalfH (C88.2 R69.1), MotorCellOne (6 pins), MotorCellTwo (6 pins)
AVCC3V3: CoreCtrl (5 pins), AuxHalfH (R66.2), MotorCellOne (R28.2 U4.24), MotorCellTwo (R48.2 U5.24)
DCBUS: CoreCtrl (17 pins), AuxHalfH (Q13.5 Q13.6 Q13.7 Q13.8), MotorCellOne (19 pins), MotorCellTwo (19 pins)
DRV5V: CoreCtrl (15 pins), MotorCellOne (6 pins)
GND: CoreCtrl (52 pins), MotorCellOne (19 pins), MotorCellTwo (19 pins)
PGND: CoreCtrl (17 pins), AuxHalfH (8 pins), MotorCellOne (10 pins), MotorCellTwo (10 pins)
VCC3V3: CoreCtrl (29 pins), MotorCellOne (U4.49), MotorCellTwo (U5.49)
AUX_H: CoreCtrl (R10.1 U1.30), AuxHalfH (R63.2 U6.5)
AUX_L: CoreCtrl (R11.1 U1.29), AuxHalfH (R64.2 U6.6)
AUX_TEMP: CoreCtrl (U1.21), AuxHalfH (C88.1 R66.1 R69.2)
EN_GATE: CoreCtrl (U1.33), MotorCellOne (U4.16), MotorCellTwo (U5.16)
M0_AH: CoreCtrl (U1.41), MotorCellOne (U4.17)
M0_AL: CoreCtrl (U1.34), MotorCellOne (U4.18)
M0_BH: CoreCtrl (U1.42), MotorCellOne (U4.19)
M0_BL: CoreCtrl (U1.35), MotorCellOne (U4.20)
M0_CH: CoreCtrl (U1.43), MotorCellOne (U4.21)
M0_CL: CoreCtrl (U1.36), MotorCellOne (U4.22)
M0_nCS: CoreCtrl (U1.2), MotorCellOne (U4.8)
M0_SO_N: CoreCtrl (U1.8), MotorCellOne (C57.2 R32.1)
M0_SO_P: CoreCtrl (U1.9), MotorCellOne (R33.1 R35.2)
M0_TEMP: CoreCtrl (U1.25), MotorCellOne (C45.1 R28.1 R30.2)
M1_AH: CoreCtrl (U1.37), MotorCellTwo (U5.17)
M1_AL: CoreCtrl (U1.23), MotorCellTwo (U5.18)
M1_BH: CoreCtrl (U1.38), MotorCellTwo (U5.19)
M1_BL: CoreCtrl (U1.26), MotorCellTwo (U5.20)
M1_CH: CoreCtrl (U1.39), MotorCellTwo (U5.21)
M1_CL: CoreCtrl (U1.27), MotorCellTwo (U5.22)
M1_nCS: CoreCtrl (U1.3), MotorCellTwo (U5.8)
M1_SO_N: CoreCtrl (U1.11), MotorCellTwo (C80.2 R52.1)
M1_SO_P: CoreCtrl (U1.10), MotorCellTwo (C81.2 R53.1)
M1_TEMP: CoreCtrl (U1.20), MotorCellTwo (C68.1 R48.1 R50.2)
nFAULT: CoreCtrl (U1.54), MotorCellOne (U4.6), MotorCellTwo (U5.6)
SPI_MISO: CoreCtrl (P6.4 P7.4 U1.52), MotorCellOne (U4.10), MotorCellTwo (U5.10)
SPI_MOSI: CoreCtrl (P6.5 P7.5 U1.53), MotorCellOne (U4.9), MotorCellTwo (U5.9)
SPI_SCK: CoreCtrl (P6.3 P7.3 U1.51), MotorCellOne (U4.11), MotorCellTwo (U5.11)
VCC12V: AuxHalfH (C87.1 U6.1), MotorCellTwo (6 pins)